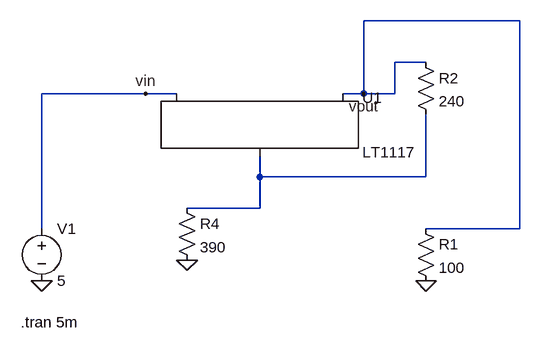
[diagram p0: schematic power_schematic.asc]
power_schematic.asc, the LTspice schematic file:
Version 4.1
SHEET 1 880 680
WIRE 832 -208 592 -208
WIRE 688 -144 640 -144
WIRE 256 -96 96 -96
WIRE 304 -96 256 -96
WIRE 592 -96 592 -208
WIRE 592 -96 560 -96
WIRE 640 -96 640 -144
WIRE 640 -96 592 -96
WIRE 432 32 432 0
WIRE 688 32 688 -64
WIRE 688 32 432 32
WIRE 432 80 432 32
WIRE 432 80 320 80
WIRE 96 112 96 -96
WIRE 832 112 832 -208
WIRE 832 112 688 112
FLAG 96 192 0
FLAG 320 160 0
FLAG 688 192 0
FLAG 256 -96 vin
FLAG 592 -96 vout
DATAFLAG 96 80 ""
SYMBOL res 304 64 R0
SYMATTR InstName R4
SYMATTR Value 390
SYMBOL voltage 96 96 R0
SYMATTR InstName V1
SYMATTR Value 5
SYMBOL res 672 96 R0
SYMATTR InstName R1
SYMATTR Value 100
SYMBOL PowerProducts\\LT1117 432 -96 R0
SYMATTR InstName U1
SYMBOL res 672 -160 R0
SYMATTR InstName R2
SYMATTR Value 240
TEXT 64 256 Left 2 !.tran 5m

The netlist it stands for:
* power_schematic.asc
R4 N001 0 390
V1 vin 0 5
R1 vout 0 100
X§U1 N001 vout vin LT1117
R2 vout N001 240
.tran 5m
.lib LT1117.lib
.backanno
.end